# Altium schematic sheet Sheet2.SchDoc
size A; SheetNumber: 2; SheetTotal: 3
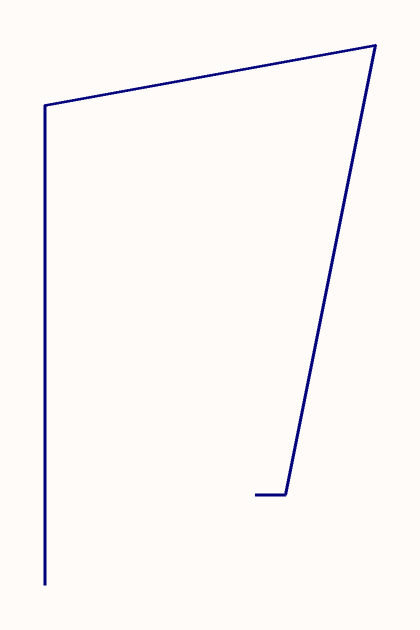
[diagram p0: Sheet2.SchDoc]